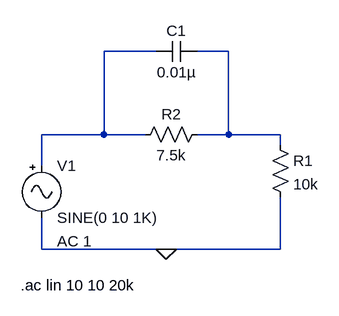
[diagram p0: schematic RC-preemphasis.asc]
RC-preemphasis.asc, the LTspice schematic file:
Version 4.1
SHEET 1 880 680
WIRE 64 -64 -16 -64
WIRE 176 -64 128 -64
WIRE -16 64 -16 -64
WIRE -16 64 -112 64
WIRE 48 64 -16 64
WIRE 176 64 176 -64
WIRE 176 64 128 64
WIRE 256 64 176 64
WIRE 256 80 256 64
WIRE -112 112 -112 64
WIRE -112 240 -112 192
WIRE 80 240 -112 240
WIRE 256 240 256 160
WIRE 256 240 80 240
FLAG 80 240 0
SYMBOL res 240 64 R0
SYMATTR InstName R1
SYMATTR Value 10k
SYMBOL res 144 48 R90
WINDOW 0 0 56 VBottom 2
WINDOW 3 32 56 VTop 2
SYMATTR InstName R2
SYMATTR Value 7.5k
SYMBOL cap 128 -80 R90
WINDOW 0 0 32 VBottom 2
WINDOW 3 32 32 VTop 2
SYMATTR InstName C1
SYMATTR Value 0.01µ
SYMBOL Misc\\signal -112 96 R0
WINDOW 123 24 132 Left 2
WINDOW 39 0 0 Left 0
SYMATTR Value2 AC 1
SYMATTR InstName V1
SYMATTR Value SINE(0 10 1K)
TEXT -144 296 Left 2 !.ac lin 10 10 20k

The netlist it stands for:
* RC-preemphasis.asc
R1 N002 0 10k
R2 N002 N001 7.5k
C1 N002 N001 0.01µ
V1 N001 0 SINE(0 10 1K) AC 1
.ac lin 10 10 20k
.backanno
.end